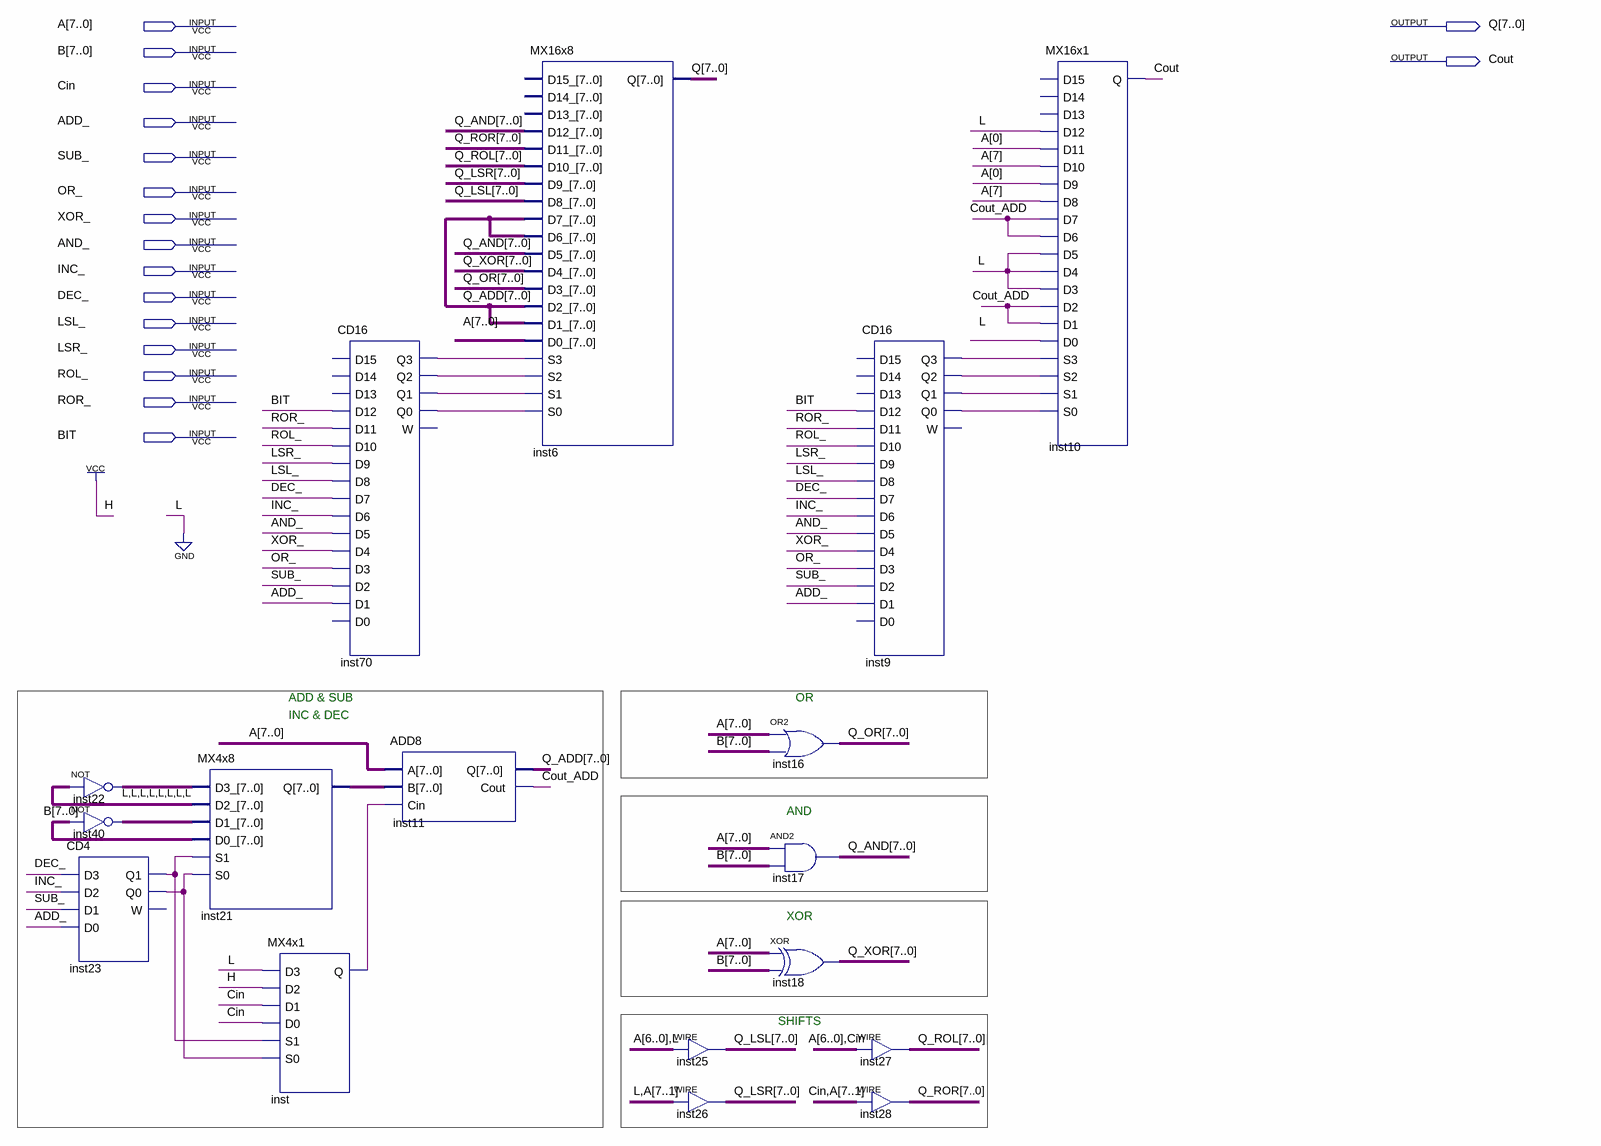
[diagram p0: schematic sheet]
// Quartus schematic ALU.bdf as structural Verilog: 17 symbols, 17 pins
module ALU (
  input  [7:0] A,
  input  [7:0] B,
  input  Cin,
  input  ADD_,
  input  SUB_,
  input  OR_,
  input  XOR_,
  input  AND_,
  input  INC_,
  input  DEC_,
  input  LSL_,
  input  LSR_,
  input  ROL_,
  input  ROR_,
  input  BIT,
  output [7:0] Q,
  output Cout
);

  wire Cout_ADD, inst9_q0, inst9_q1, inst9_q2, inst9_q3, inst23_q0, inst23_q1, inst70_q0, inst70_q1,
       inst70_q2, inst70_q3, inst_q;
  wire [7:0] inst21_q, inst22_out, inst40_out, Q_ADD, Q_AND, Q_LSL, Q_LSR, Q_OR, Q_ROL, Q_ROR, Q_XOR;

  assign inst22_out = ~{8{1'b0}};  // NOT inst22, 8 bits wide
  assign inst40_out = ~B;  // NOT inst40, 8 bits wide
  CD4 inst23 (.D3(DEC_), .D2(INC_), .D1(SUB_), .D0(ADD_), .Q1(inst23_q1), .Q0(inst23_q0));  // open: W
  MX4x8 inst21 (
    .D3_(inst22_out), .D2_({8{1'b0}}), .D1_(inst40_out), .D0_(B), .S1(inst23_q1), .S0(inst23_q0), .Q(inst21_q));
  MX4x1 inst (.D3(1'b0), .D2(1'b1), .D1(Cin), .D0(Cin), .S1(inst23_q1), .S0(inst23_q0), .Q(inst_q));
  CD16 inst70 (
    .D12(BIT), .D11(ROR_), .D10(ROL_), .D9(LSR_), .D8(LSL_), .D7(DEC_), .D6(INC_), .D5(AND_), .D4(XOR_),
    .D3(OR_), .D2(SUB_), .D1(ADD_), .Q3(inst70_q3), .Q2(inst70_q2), .Q1(inst70_q1), .Q0(inst70_q0));  // open: D15, D14, D13, D0, W
  ADD8 inst11 (.A(A), .B(inst21_q), .Cin(inst_q), .Q(Q_ADD), .Cout(Cout_ADD));
  MX16x8 inst6 (
    .D12_(Q_AND), .D11_(Q_ROR), .D10_(Q_ROL), .D9_(Q_LSR), .D8_(Q_LSL), .D7_(Q_ADD), .D6_(Q_ADD),
    .D5_(Q_AND), .D4_(Q_XOR), .D3_(Q_OR), .D2_(Q_ADD), .D1_(Q_ADD), .D0_(A), .S3(inst70_q3), .S2(inst70_q2),
    .S1(inst70_q1), .S0(inst70_q0), .Q(Q));  // open: D15_, D14_, D13_
  assign Q_LSL = {A[6:0], 1'b0};  // WIRE inst25
  assign Q_LSR = {1'b0, A[7:1]};  // WIRE inst26
  assign Q_OR = A | B;  // OR2 inst16, 8 bits wide
  assign Q_AND = A & B;  // AND2 inst17, 8 bits wide
  assign Q_XOR = A ^ B;  // XOR inst18, 8 bits wide
  CD16 inst9 (
    .D12(BIT), .D11(ROR_), .D10(ROL_), .D9(LSR_), .D8(LSL_), .D7(DEC_), .D6(INC_), .D5(AND_), .D4(XOR_),
    .D3(OR_), .D2(SUB_), .D1(ADD_), .Q3(inst9_q3), .Q2(inst9_q2), .Q1(inst9_q1), .Q0(inst9_q0));  // open: D15, D14, D13, D0, W
  assign Q_ROL = {A[6:0], Cin};  // WIRE inst27
  assign Q_ROR = {Cin, A[7:1]};  // WIRE inst28
  MX16x1 inst10 (
    .D12(1'b0), .D11(A[0]), .D10(A[7]), .D9(A[0]), .D8(A[7]), .D7(Cout_ADD), .D6(Cout_ADD), .D5(1'b0),
    .D4(1'b0), .D3(1'b0), .D2(Cout_ADD), .D1(Cout_ADD), .D0(1'b0), .S3(inst9_q3), .S2(inst9_q2),
    .S1(inst9_q1), .S0(inst9_q0), .Q(Cout));  // open: D15, D14, D13

  // Notes on the sheet:
  //   ADD & SUB
  //   OR
  //   INC & DEC
  //   AND
  //   XOR
  //   SHIFTS
endmodule
